# Altium schematic sheet clock_eagle_1.SchDoc
size 411 x 260 mm
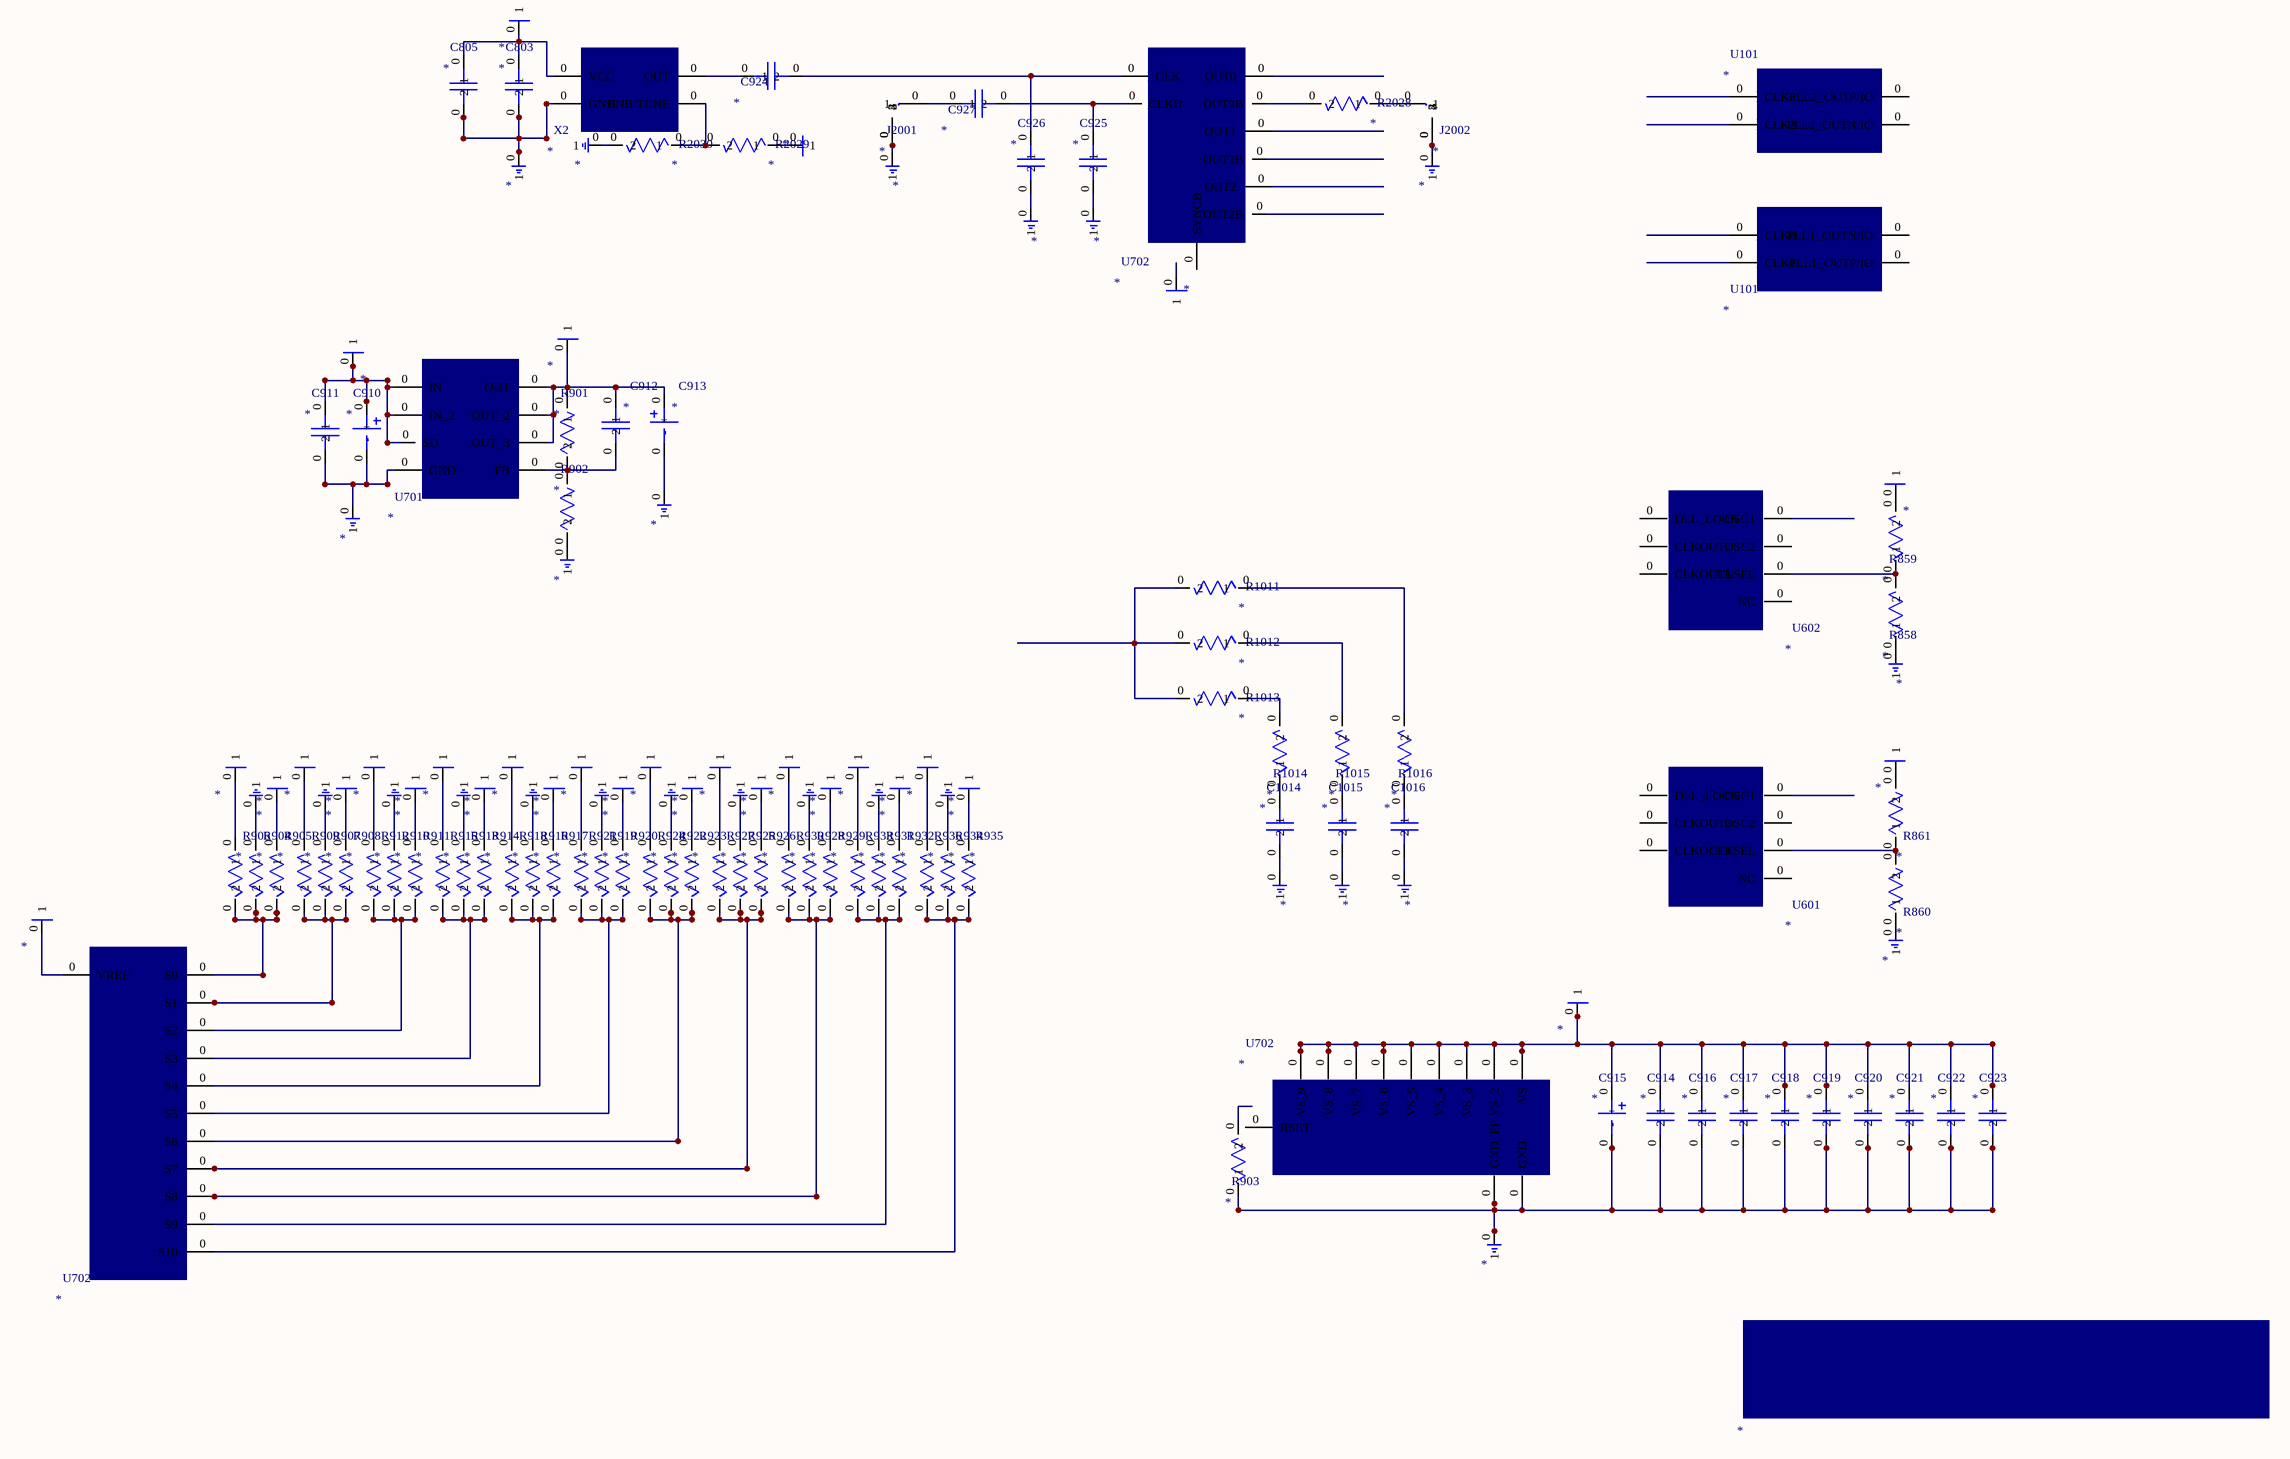
[diagram p0: clock_eagle_1.SchDoc]

## Parts
C803  *
C805  *
C910  *
C911  *
C912  *
C913  *
C914  *
C915  *
C916  *
C917  *
C918  *
C919  *
C920  *
C921  *
C922  *
C923  *
C924  *
C925  *
C926  *
C927  *
C1014  *
C1015  *
C1016  *
CVSTITLEBLOCK-1  *
GENERIC-POWER  *
GENERIC-POWER-0  *
GENERIC-POWER-5  *
GENERIC-POWER-13  *
GENERIC-POWER-20  *
GENERIC-POWER-22  *
GENERIC-POWER-23  *
GENERIC-POWER-25  *
GENERIC-POWER-26  *
GENERIC-POWER-28  *
GENERIC-POWER-29  *
GENERIC-POWER-31  *
GENERIC-POWER-32  *
GENERIC-POWER-34  *
GENERIC-POWER-35  *
GENERIC-POWER-37  *
GENERIC-POWER-38  *
GENERIC-POWER-40  *
GENERIC-POWER-41  *
GENERIC-POWER-43  *
GENERIC-POWER-44  *
GENERIC-POWER-46  *
GENERIC-POWER-47  *
GENERIC-POWER-49  *
GENERIC-POWER-50  *
GENERIC-POWER-52  *
GENERIC-POWER-53  *
GENERIC-POWER-54  *
GENERIC-POWER-55  *
GENERIC-POWER_MIRRORED  *
GENERIC-POWER_MIRRORED-11  *
GND-1  *
GND-1-6  *
GND-1-7  *
GND-1-8  *
GND-1-12  *
GND-1-16  *
GND-1-19  *
GND-1-21  *
GND-1-24  *
GND-1-27  *
GND-1-30  *
GND-1-33  *
GND-1-36  *
GND-1-39  *
GND-1-42  *
GND-1-45  *
GND-1-48  *
GND-1-51  *
GND-1_MIRRORED  *
GND-1_MIRRORED-1  *
GND-1_MIRRORED-2  *
GND-1_MIRRORED-3  *
GND-1_MIRRORED-4  *
GND-1_MIRRORED-10  *
GND-1_MIRRORED-17  *
GND-1_MIRRORED-18  *
J2001  *
J2002  *
R858  *
R859  *
R860  *
R861  *
R901  *
R902  *
R903  *
R904  *
R905  *
R906  *
R907  *
R908  *
R909  *
R910  *
R911  *
R912  *
R913  *
R914  *
R915  *
R916  *
R917  *
R918  *
R919  *
R920  *
R921  *
R922  *
R923  *
R924  *
R925  *
R926  *
R927  *
R928  *
R929  *
R930  *
R931  *
R932  *
R933  *
R934  *
R935  *
R936  *
R1011  *
R1012  *
R1013  *
R1014  *
R1015  *
R1016  *
R2028  *
R2029  *
R2030  *
U101  *
U101-9  *
U601  *
U602  *
U701  *
U702  *
U702-14  *
U702-15  *
X2  *

## Nets
NetC803_0: C803.0(1) C805.0(1) GENERIC-POWER.0(1) X2.0(VCC)
NetC803_0: C803.0(2) C805.0(2) GND-1.0(1) X2.0(GND)  [a separate net that carries the same name]
NetC910_0: C910.0(+) C911.0(1) GENERIC-POWER_MIRRORED.0(1) U701.0(IN)
NetC910_0: C910.0(-) C911.0(2) GND-1-6.0(1) U701.0(GND)  [a separate net that carries the same name]
NetC912_0: C912.0(1) C913.0(+) GENERIC-POWER-5.0(1) R901.0(1) U701.0(OUT)
NetC912_0: C912.0(2) R901.0(2) R902.0(1) U701.0(FB)  [a separate net that carries the same name]
NetC913_0: C913.0(-) GND-1-8.0(1)
NetC914_0: C914.0(1) C915.0(+) C916.0(1) C917.0(1) C918.0(1) C919.0(1) C920.0(1) C921.0(1) C922.0(1) C923.0(1) GENERIC-POWER-55.0(1) U702-15.0(VS)
NetC914_0: C914.0(2) C915.0(-) C916.0(2) C917.0(2) C918.0(2) C919.0(2) C920.0(2) C921.0(2) C922.0(2) C923.0(2) GND-1-16.0(1) R903.0(1) U702-15.0(GND)  [a separate net that carries the same name]
NetC924_0: C924.0(1) X2.0(OUT)
NetC924_0: C924.0(2) C926.0(1) U702.0(CLK)  [a separate net that carries the same name]
NetC925_0: C925.0(1) C927.0(2) U702.0(CLKB)
NetC925_0: C925.0(2) GND-1_MIRRORED-17.0(1)  [a separate net that carries the same name]
NetC926_0: C926.0(2) GND-1_MIRRORED-18.0(1)
NetC927_0: C927.0(1) J2001.0(1)
NetC1014_0: C1014.0(1) R1014.0(1)
NetC1014_0: C1014.0(2) GND-1_MIRRORED.0(1)  [a separate net that carries the same name]
NetC1015_0: C1015.0(1) R1015.0(1)
NetC1015_0: C1015.0(2) GND-1_MIRRORED-1.0(1)  [a separate net that carries the same name]
NetC1016_0: C1016.0(1) R1016.0(1)
NetC1016_0: C1016.0(2) GND-1_MIRRORED-2.0(1)  [a separate net that carries the same name]
NetGENERIC-POWER-0_0: GENERIC-POWER-0.0(1) R2029.0(1)
NetGENERIC-POWER-13_0: GENERIC-POWER-13.0(1) R861.0(2)
NetGENERIC-POWER-22_0: GENERIC-POWER-22.0(1) R905.0(1)
NetGENERIC-POWER-23_0: GENERIC-POWER-23.0(1) R906.0(1)
NetGENERIC-POWER-25_0: GENERIC-POWER-25.0(1) R908.0(1)
NetGENERIC-POWER-26_0: GENERIC-POWER-26.0(1) R909.0(1)
NetGENERIC-POWER-28_0: GENERIC-POWER-28.0(1) R911.0(1)
NetGENERIC-POWER-29_0: GENERIC-POWER-29.0(1) R912.0(1)
NetGENERIC-POWER-31_0: GENERIC-POWER-31.0(1) R914.0(1)
NetGENERIC-POWER-32_0: GENERIC-POWER-32.0(1) R915.0(1)
NetGENERIC-POWER-34_0: GENERIC-POWER-34.0(1) R917.0(1)
NetGENERIC-POWER-35_0: GENERIC-POWER-35.0(1) R918.0(1)
NetGENERIC-POWER-37_0: GENERIC-POWER-37.0(1) R920.0(1)
NetGENERIC-POWER-38_0: GENERIC-POWER-38.0(1) R921.0(1)
NetGENERIC-POWER-40_0: GENERIC-POWER-40.0(1) R923.0(1)
NetGENERIC-POWER-41_0: GENERIC-POWER-41.0(1) R924.0(1)
NetGENERIC-POWER-43_0: GENERIC-POWER-43.0(1) R926.0(1)
NetGENERIC-POWER-44_0: GENERIC-POWER-44.0(1) R927.0(1)
NetGENERIC-POWER-46_0: GENERIC-POWER-46.0(1) R929.0(1)
NetGENERIC-POWER-47_0: GENERIC-POWER-47.0(1) R930.0(1)
NetGENERIC-POWER-49_0: GENERIC-POWER-49.0(1) R932.0(1)
NetGENERIC-POWER-50_0: GENERIC-POWER-50.0(1) R933.0(1)
NetGENERIC-POWER-52_0: GENERIC-POWER-52.0(1) R935.0(1)
NetGENERIC-POWER-53_0: GENERIC-POWER-53.0(1) R936.0(1)
NetGENERIC-POWER-54_0: GENERIC-POWER-54.0(1) U702-14.0(VREF)
NetGENERIC-POWER_MIRRORED-11_0: GENERIC-POWER_MIRRORED-11.0(1) R859.0(2)
NetGND-1-7_0: GND-1-7.0(1) R902.0(2)
NetGND-1-12_0: GND-1-12.0(1) R860.0(1)
NetGND-1-19_0: GND-1-19.0(1) J2002.0(2)
NetGND-1-21_0: GND-1-21.0(1) R904.0(1)
NetGND-1-24_0: GND-1-24.0(1) R907.0(1)
NetGND-1-27_0: GND-1-27.0(1) R910.0(1)
NetGND-1-30_0: GND-1-30.0(1) R913.0(1)
NetGND-1-33_0: GND-1-33.0(1) R916.0(1)
NetGND-1-36_0: GND-1-36.0(1) R919.0(1)
NetGND-1-39_0: GND-1-39.0(1) R922.0(1)
NetGND-1-42_0: GND-1-42.0(1) R925.0(1)
NetGND-1-45_0: GND-1-45.0(1) R928.0(1)
NetGND-1-48_0: GND-1-48.0(1) R931.0(1)
NetGND-1-51_0: GND-1-51.0(1) R934.0(1)
NetGND-1_MIRRORED-3_0: GND-1_MIRRORED-3.0(1) J2001.0(2)
NetGND-1_MIRRORED-4_0: GND-1_MIRRORED-4.0(1) R2030.0(2)
NetGND-1_MIRRORED-10_0: GND-1_MIRRORED-10.0(1) R858.0(1)
NetJ2002_0: J2002.0(1) R2028.0(1)
NetR858_0: R858.0(2) R859.0(1) U602.0(CLKOUT1)
NetR860_0: R860.0(2) R861.0(1) U601.0(CLKOUT1)
NetR904_0: R904.0(2) R905.0(2) R906.0(2) U702-14.0(S0)
NetR907_0: R907.0(2) R908.0(2) R909.0(2) U702-14.0(S1)
NetR910_0: R910.0(2) R911.0(2) R912.0(2) U702-14.0(S2)
NetR913_0: R913.0(2) R914.0(2) R915.0(2) U702-14.0(S3)
NetR916_0: R916.0(2) R917.0(2) R918.0(2) U702-14.0(S4)
NetR919_0: R919.0(2) R920.0(2) R921.0(2) U702-14.0(S5)
NetR922_0: R922.0(2) R923.0(2) R924.0(2) U702-14.0(S6)
NetR925_0: R925.0(2) R926.0(2) R927.0(2) U702-14.0(S7)
NetR928_0: R928.0(2) R929.0(2) R930.0(2) U702-14.0(S8)
NetR931_0: R931.0(2) R932.0(2) R933.0(2) U702-14.0(S9)
NetR934_0: R934.0(2) R935.0(2) R936.0(2) U702-14.0(S10)
NetR1011_0: R1011.0(1) R1016.0(2)
NetR1011_0: R1011.0(2) R1012.0(2) R1013.0(2)  [a separate net that carries the same name]
NetR1012_0: R1012.0(1) R1015.0(2)
NetR1013_0: R1013.0(1) R1014.0(2)
NetR2028_0: R2028.0(2) U702.0(OUT0B)
NetR2029_0: R2029.0(2) R2030.0(1) X2.0(ENB/TUNE)

Not connected (* = marked no-connect by the designer): GENERIC-POWER-20 0(1); U101 0(CLK0); U101-9 0(CLK2)

## Notes on the sheet
- (in symbol AD9513-CTRL) U702
- (in symbol AD9513-PWR) U702
- (in symbol EP1C12-PQ240-CLKB_MIRRORED) U101

## Library data of the parts
C803 C805 C911 C914 C916-C927 C1014-C1016 = CAPACITOR-1
C910 C915 = CAPACITOR-2
C912 = CAPACITOR-1_MIRRORED
C913 = CAPACITOR-2_MIRRORED
CVSTITLEBLOCK-1 = CVSTITLEBLOCK-1
GENERIC-POWER GENERIC-POWER-0 GENERIC-POWER-5 GENERIC-POWER-13 GENERIC-POWER-20 GENERIC-POWER-22 GENERIC-POWER-23 GENERIC-POWER-25 GENERIC-POWER-26 GENERIC-POWER-28 GENERIC-POWER-29 GENERIC-POWER-31 GENERIC-POWER-32 GENERIC-POWER-34 GENERIC-POWER-35 GENERIC-POWER-37 GENERIC-POWER-38 GENERIC-POWER-40 GENERIC-POWER-41 GENERIC-POWER-43 GENERIC-POWER-44 GENERIC-POWER-46 GENERIC-POWER-47 GENERIC-POWER-49 GENERIC-POWER-50 GENERIC-POWER-52-GENERIC-POWER-55 = GENERIC-POWER
GENERIC-POWER_MIRRORED GENERIC-POWER_MIRRORED-11 = GENERIC-POWER_MIRRORED
GND-1 GND-1-6-GND-1-8 GND-1-12 GND-1-16 GND-1-19 GND-1-21 GND-1-24 GND-1-27 GND-1-30 GND-1-33 GND-1-36 GND-1-39 GND-1-42 GND-1-45 GND-1-48 GND-1-51 = GND-1
GND-1_MIRRORED GND-1_MIRRORED-1-GND-1_MIRRORED-4 GND-1_MIRRORED-10 GND-1_MIRRORED-17 GND-1_MIRRORED-18 = GND-1_MIRRORED
J2001 = SMA-5
J2002 = SMA-5_MIRRORED
R858 R859 R903-R936 R1011-R1016 R2028-R2030 = RESISTOR-1_MIRRORED
R860 R861 R901 R902 = RESISTOR-1
U101 = EP1C12-PQ240-CLKA
U101-9 = EP1C12-PQ240-CLKB_MIRRORED
U601 U602 = AD986X-CLK_MIRRORED
U701 = ADP3336
U702 = AD9513-CLK
U702-14 = AD9513-CTRL
U702-15 = AD9513-PWR
X2 = VCTCXO